# EAGLE schematic aw_801_oscilloscope (EAGLE 6.4)
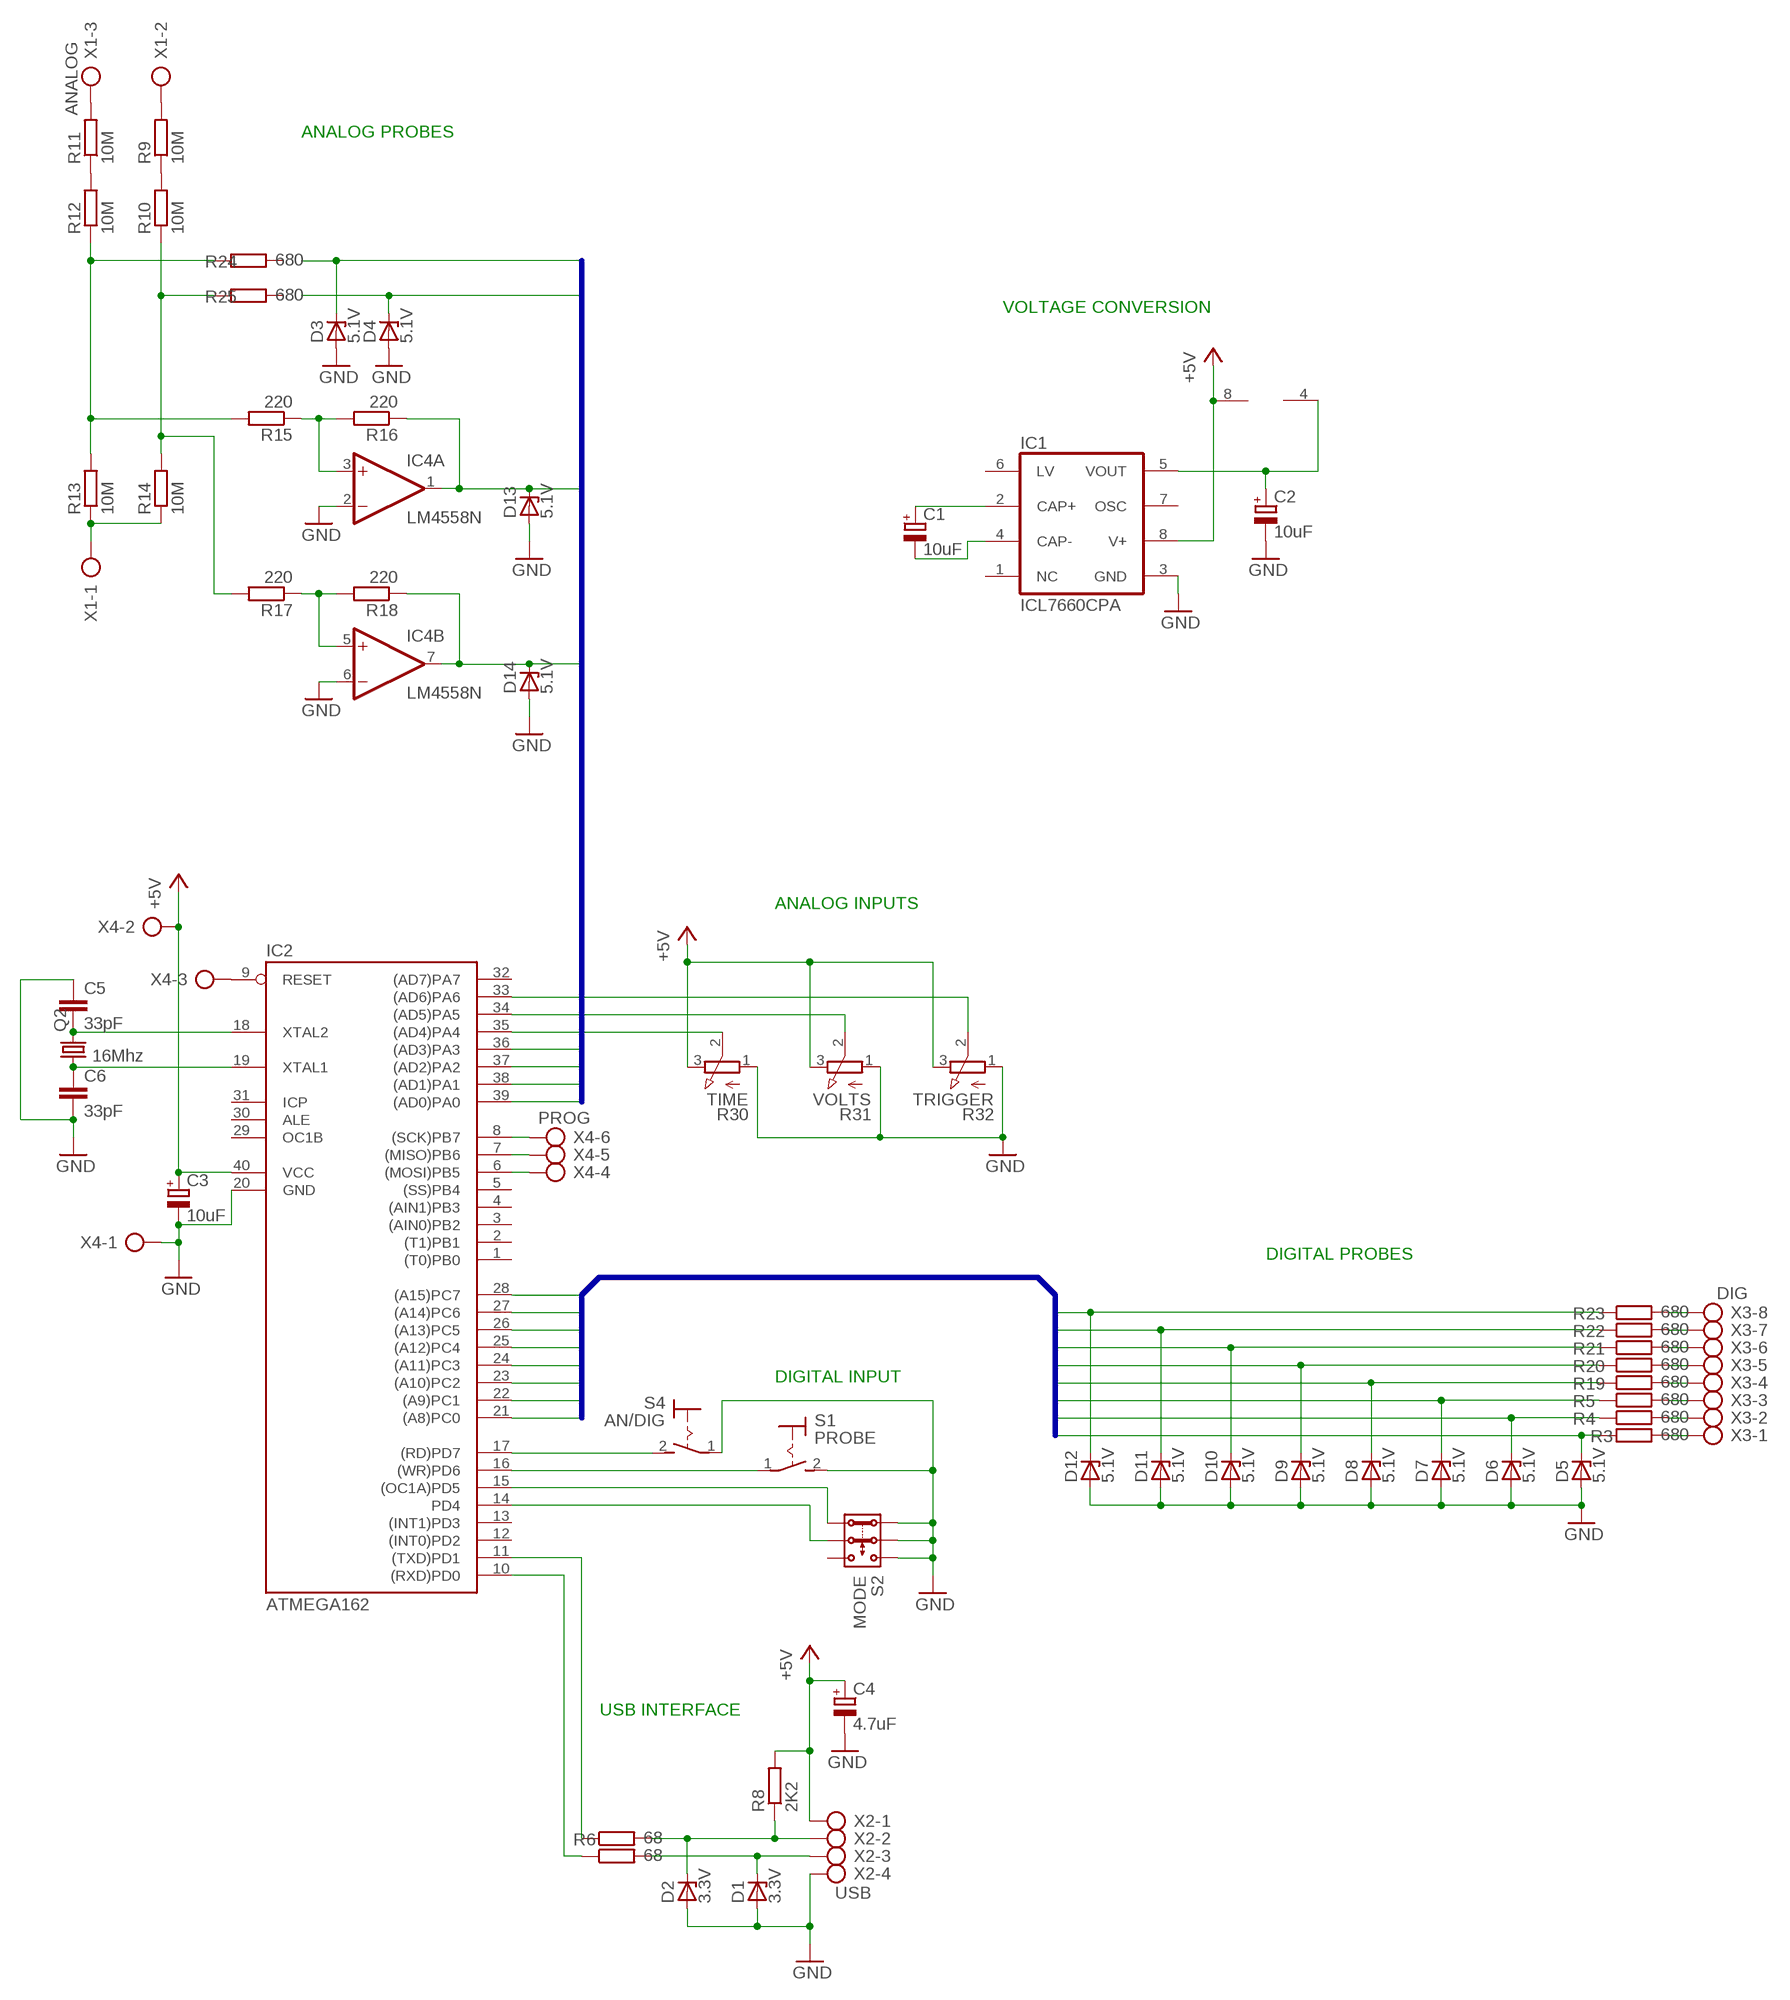
[diagram p0: schematic, sheet 1]

## Parts
C1  10uF  CPOL-EUE2.5-6  [E2,5-6]
C2  10uF  CPOL-EUE2.5-6  [E2,5-6]
C3  10uF  CPOL-EUE2.5-6  [E2,5-6]
C4  4.7uF  CPOL-EUE2.5-6  [E2,5-6]
C5  33pF  C-EU050-030X075  [C050-030X075]
C6  33pF  C-EU050-030X075  [C050-030X075]
D1  3.3V  ZENER-DIODEDO35Z10  [DO35Z10]
D2  3.3V  ZENER-DIODEDO35Z10  [DO35Z10]
D3  5.1V  ZENER-DIODEDO35Z10  [DO35Z10]
D4  5.1V  ZENER-DIODEDO35Z10  [DO35Z10]
D5  5.1V  ZENER-DIODEDO35Z10  [DO35Z10]
D6  5.1V  ZENER-DIODEDO35Z10  [DO35Z10]
D7  5.1V  ZENER-DIODEDO35Z10  [DO35Z10]
D8  5.1V  ZENER-DIODEDO35Z10  [DO35Z10]
D9  5.1V  ZENER-DIODEDO35Z10  [DO35Z10]
D10  5.1V  ZENER-DIODEDO35Z10  [DO35Z10]
D11  5.1V  ZENER-DIODEDO35Z10  [DO35Z10]
D12  5.1V  ZENER-DIODEDO35Z10  [DO35Z10]
D13  5.1V  ZENER-DIODEDO35Z10  [DO35Z10]
D14  5.1V  ZENER-DIODEDO35Z10  [DO35Z10]
IC1  ICL7660CPA  [DIL08]
IC2  ATMEGA162  AT90S8515P  [DIL40]
IC4  LM4558N  [DIL08]
Q2  16Mhz  CRYSTALHC49U70  [HC49U70]
R3  680  R-EU_0207/10  [0207/10]
R4  680  R-EU_0207/10  [0207/10]
R5  680  R-EU_0207/10  [0207/10]
R6  68  R-EU_0207/10  [0207/10]
R7  68  R-EU_0207/10  [0207/10]
R8  2K2  R-EU_0207/10  [0207/10]
R9  10M  R-EU_0207/10  [0207/10]
R10  10M  R-EU_0207/10  [0207/10]
R11  10M  R-EU_0207/10  [0207/10]
R12  10M  R-EU_0207/10  [0207/10]
R13  10M  R-EU_0207/10  [0207/10]
R14  10M  R-EU_0207/10  [0207/10]
R15  220  R-EU_0207/10  [0207/10]
R16  220  R-EU_0207/10  [0207/10]
R17  220  R-EU_0207/10  [0207/10]
R18  220  R-EU_0207/10  [0207/10]
R19  680  R-EU_0207/10  [0207/10]
R20  680  R-EU_0207/10  [0207/10]
R21  680  R-EU_0207/10  [0207/10]
R22  680  R-EU_0207/10  [0207/10]
R23  680  R-EU_0207/10  [0207/10]
R24  680  R-EU_0207/10  [0207/10]
R25  680  R-EU_0207/10  [0207/10]
R30  TIME  3RP/1610N  [3RP/1610N]
R31  VOLTS  3RP/1610N  [3RP/1610N]
R32  TRIGGER  3RP/1610N  [3RP/1610N]
S1  PROBE  MS243  [MS243]
S2  MODE  2P2T  [2P2T]
S4  AN/DIG  MS243  [MS243]
X1  ANALOG  AK500/3  [AK500/3]
X2  USB  AK500/4  [AK500/4]
X3  DIG  AK500/8  [AK500/8]
X4  PROG  AK300/6  [AK300/6]

## Nets
+5V: C3.+ C4.+ IC1.8(V+) IC2.40(VCC) IC4.8(P:V+) R8.2 R30.3(E) R31.3(E) R32.3(E) X2.1 X4.2
ANALOG0: D3.C IC2.39((AD0)PA0)
ANALOG1: D4.C IC2.38((AD1)PA1)
ANALOG2: D13.C IC2.37((AD2)PA2) IC4.1(A:OUT) R16.1
ANALOG3: D14.C IC2.36((AD3)PA3) IC4.7(B:OUT) R18.1
DIG0: D12.C IC2.21((A8)PC0) R23.1
DIG1: D11.C IC2.22((A9)PC1) R22.1
DIG2: D10.C IC2.23((A10)PC2) R21.1
DIG3: D9.C IC2.24((A11)PC3) R20.1
DIG4: D8.C IC2.25((A12)PC4) R19.1
DIG5: D7.C IC2.26((A13)PC5) R5.1
DIG6: D6.C IC2.27((A14)PC6) R4.1
DIG7: D5.C IC2.28((A15)PC7) R3.1
GND: C2.- C3.- C4.- C5.1 C6.2 D1.A D2.A D3.A D4.A D5.A D6.A D7.A D8.A D9.A D10.A D11.A D12.A D13.A D14.A IC1.3(GND) IC2.20(GND) IC4.2(A:-IN) IC4.6(B:-IN) R30.1(A) R31.1(A) R32.1(A) S1.2(S) S2.1.1 S2.2.1 S2.3.1 S4.1(P) X2.4 X4.1
N$1: R12.1 R13.2 R15.2 R24.1
N$2: C1.- IC1.4(CAP-)
N$3: C1.+ IC1.2(CAP+)
N$4: IC2.35((AD4)PA4) R30.2(S)
N$5: IC2.15((OC1A)PD5) S2.1.2
N$6: IC2.14(PD4) S2.2.2
N$7: C5.2 IC2.18(XTAL2) Q2.2
N$8: C6.1 IC2.19(XTAL1) Q2.1
N$9: D2.C R6.2 R8.1 X2.2
N$10: D1.C R7.2 X2.3
N$11: IC2.8((SCK)PB7) X4.6
N$12: IC2.10((RXD)PD0) R7.1
N$13: R11.2 X1.3
N$14: R9.1 R10.2
N$15: R11.1 R12.2
N$16: R10.1 R14.2 R17.2 R25.1
N$17: IC4.3(A:+IN) R15.1 R16.2
N$18: IC2.34((AD5)PA5) R31.2(S)
N$19: IC4.5(B:+IN) R17.1 R18.2
N$20: IC2.33((AD6)PA6) R32.2(S)
N$21: R9.2 X1.2
N$22: IC2.7((MISO)PB6) X4.5
N$23: IC2.6((MOSI)PB5) X4.4
N$24: R13.1 R14.1 X1.1
N$25: R23.2 X3.8
N$26: R22.2 X3.7
N$27: R21.2 X3.6
N$28: R20.2 X3.5
N$29: R19.2 X3.4
N$30: R5.2 X3.3
N$31: R4.2 X3.2
N$32: R3.2 X3.1
N$33: IC2.9(RESET) X4.3
N$34: IC2.17((RD)PD7) S4.2(S)
N$36: IC2.16((WR)PD6) S1.1(P)
N$37: IC2.11((TXD)PD1) R6.1
VOUT: C2.+ IC1.5(VOUT) IC4.4(P:V-)
Unconnected: IC1.1(NC) IC1.6(LV) IC1.7(OSC) IC2.1((T0)PB0) IC2.2((T1)PB1) IC2.3((AIN0)PB2) IC2.4((AIN1)PB3) IC2.5((SS)PB4) IC2.12((INT0)PD2) IC2.13((INT1)PD3) IC2.29(OC1B) IC2.30(ALE) IC2.31(ICP) IC2.32((AD7)PA7) R24.2 R25.2 S2.3.2

## Buses
DIG[0..7]
ANALOG[0..3]

## Notes on the sheet
- ANALOG PROBES
- VOLTAGE CONVERSION
- ANALOG INPUTS
- DIGITAL PROBES
- DIGITAL INPUT
- USB INTERFACE

## Library data of the parts
C1-C4 = rcl:CPOL-EU: POLARIZED CAPACITOR, European symbol
C5 C6 = rcl:C-EU: CAPACITOR, European symbol
D1-D14 = diode:ZENER-DIODE: Z-Diode
IC1 = maxim:ICL7660CPA: VOLTAGE CONVERTER; MF: INTERSIL; MPN: ICL7660CPA; OC_FARNELL: 1018170; OC_NEWARK: 06F7441
IC2 = atmel:AT90S8515P: MICROCONTROLLER 8 Kbytes FLASH 512 bytes SRAM 512 bytes EEPROM UART; OC_FARNELL: unknown; OC_NEWARK: unknown
IC4 = linear:*4558: OP AMP
Q2 = crystal:CRYSTAL: CRYSTAL; OC_FARNELL: unknown; OC_NEWARK: unknown
R3-R25 = rcl:R-EU_: RESISTOR, European symbol
R30-R32 = pot:3RP/1610N: 16mm Potentiometer one level Source: http://www.alphapotentiometers.net/html/16mm_pot_2.html
S1 S4 = switch:MS243: TOGGLE SWITCH
S2 = switch:2P2T: SLIDE SWITCH 2P2T Part No. SS-22F05-G(A)4 Source: CANAL ELECTRONIC CO., LTD .. switsch.pdf
X1 = con-ptr500:AK500/3: CONNECTOR; OC_FARNELL: unknown; OC_NEWARK: unknown
X2 = con-ptr500:AK500/4: CONNECTOR; OC_FARNELL: unknown; OC_NEWARK: unknown
X3 = con-ptr500:AK500/8: CONNECTOR; OC_FARNELL: unknown; OC_NEWARK: unknown
X4 = con-ptr500:AK300/6: CONNECTOR; OC_FARNELL: unknown; OC_NEWARK: unknown